# EAGLE schematic ram (EAGLE 7.3.0)
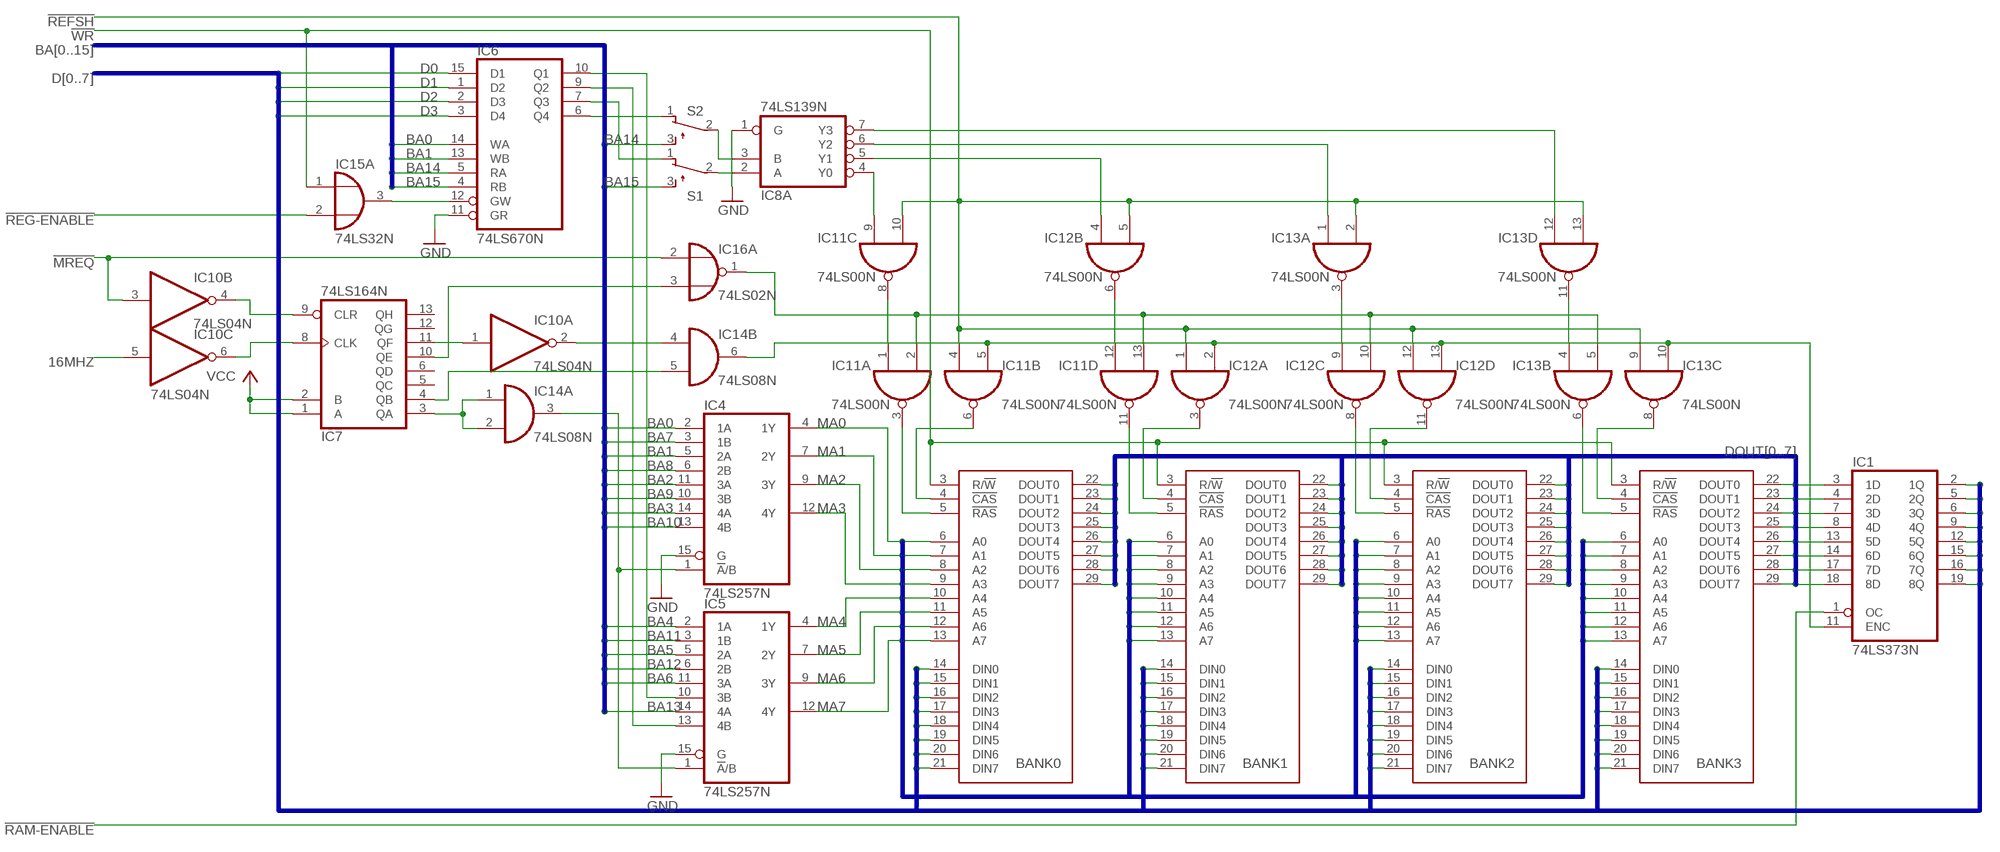
[diagram p0: schematic, sheet 1]

## Parts
BANK0  RAMBANK  [SIP29]
BANK1  RAMBANK  [SIP29]
BANK2  RAMBANK  [SIP29]
BANK3  RAMBANK  [SIP29]
IC1  74LS373N  [DIL20]
IC4  74LS257N  [DIL16]
IC5  74LS257N  [DIL16]
IC6  74LS670N  [DIL16]
IC7  74LS164N  [DIL14]
IC8  74LS139N  [DIL16]
IC10  74LS04N  [DIL14]
IC11  74LS00N  [DIL14]
IC12  74LS00N  [DIL14]
IC13  74LS00N  [DIL14]
IC14  74LS08N  [DIL14]
IC15  74LS32N  [DIL14]
IC16  74LS02N  [DIL14]
S1  TL32PO  [TL3XPO]
S2  TL32PO  [TL3XPO]

## Nets
16MHZ: IC10.5(C:I)
!MREQ!: IC10.3(B:I) IC16.2(A:I0)
!RAM-ENABLE!: IC1.1(OC)
!REFSH!: IC11.4(B:I0) IC11.10(C:I1) IC12.1(A:I0) IC12.5(B:I1) IC12.12(D:I0) IC13.2(A:I1) IC13.9(C:I0) IC13.13(D:I1)
!REG-ENABLE!: IC15.2(A:I1)
!WR!: BANK0.3(R/!W!) BANK1.3(R/!W!) BANK2.3(R/!W!) BANK3.3(R/!W!) IC15.1(A:I0)
BA0: IC4.2(1A) IC6.14(WA)
BA1: IC4.5(2A) IC6.13(WB)
BA2: IC4.11(3A)
BA3: IC4.14(4A)
BA4: IC5.2(1A)
BA5: IC5.5(2A)
BA6: IC5.11(3A)
BA7: IC4.3(1B)
BA8: IC4.6(2B)
BA9: IC4.10(3B)
BA10: IC4.13(4B)
BA11: IC5.3(1B)
BA12: IC5.6(2B)
BA13: IC5.14(4A)
BA14: IC6.5(RA) S2.3(S)
BA15: IC6.4(RB) S1.3(S)
D0: BANK0.14(DIN0) BANK1.14(DIN0) BANK2.14(DIN0) BANK3.14(DIN0) IC1.2(1Q) IC6.15(D1)
D1: BANK0.15(DIN1) BANK1.15(DIN1) BANK2.15(DIN1) BANK3.15(DIN1) IC1.5(2Q) IC6.1(D2)
D2: BANK0.16(DIN2) BANK1.16(DIN2) BANK2.16(DIN2) BANK3.16(DIN2) IC1.6(3Q) IC6.2(D3)
D3: BANK0.17(DIN3) BANK1.17(DIN3) BANK2.17(DIN3) BANK3.17(DIN3) IC1.9(4Q) IC6.3(D4)
D4: BANK0.18(DIN4) BANK0.19(DIN5) BANK1.18(DIN4) BANK2.18(DIN4) BANK3.18(DIN4) IC1.12(5Q)
D5: BANK1.19(DIN5) BANK2.19(DIN5) BANK3.19(DIN5) IC1.15(6Q)
D6: BANK0.20(DIN6) BANK1.20(DIN6) BANK2.20(DIN6) BANK3.20(DIN6) IC1.16(7Q)
D7: BANK0.21(DIN7) BANK1.21(DIN7) BANK2.21(DIN7) BANK3.21(DIN7) IC1.19(8Q)
DOUT0: BANK0.22(DOUT0) BANK1.22(DOUT0) BANK2.22(DOUT0) BANK3.22(DOUT0) IC1.3(1D)
DOUT1: BANK0.23(DOUT1) BANK1.23(DOUT1) BANK2.23(DOUT1) BANK3.23(DOUT1) IC1.4(2D)
DOUT2: BANK0.24(DOUT2) BANK1.24(DOUT2) BANK2.24(DOUT2) BANK3.24(DOUT2)
DOUT3: BANK0.25(DOUT3) BANK1.25(DOUT3) BANK2.25(DOUT3) BANK3.25(DOUT3) IC1.7(3D) IC1.8(4D)
DOUT4: BANK0.26(DOUT4) BANK1.26(DOUT4) BANK2.26(DOUT4) BANK3.26(DOUT4) IC1.13(5D)
DOUT5: BANK0.27(DOUT5) BANK1.27(DOUT5) BANK2.27(DOUT5) BANK3.27(DOUT5) IC1.14(6D) IC1.17(7D)
DOUT6: BANK0.28(DOUT6) BANK1.28(DOUT6) BANK2.28(DOUT6) BANK3.28(DOUT6) IC1.18(8D)
DOUT7: BANK0.29(DOUT7) BANK1.29(DOUT7) BANK2.29(DOUT7) BANK3.29(DOUT7)
GND: IC4.15(G) IC5.15(G) IC6.11(GR) IC8.1(A:G)
MA0: BANK0.6(A0) BANK1.6(A0) BANK2.6(A0) BANK3.6(A0) IC4.4(1Y)
MA1: BANK0.7(A1) BANK1.7(A1) BANK2.7(A1) BANK3.7(A1) IC4.7(2Y)
MA2: BANK0.8(A2) BANK1.8(A2) BANK2.8(A2) BANK3.8(A2) IC4.9(3Y)
MA3: BANK0.9(A3) BANK1.9(A3) BANK2.9(A3) BANK3.9(A3) IC4.12(4Y)
MA4: BANK0.10(A4) BANK1.10(A4) BANK2.10(A4) BANK3.10(A4) IC5.4(1Y)
MA5: BANK0.11(A5) BANK1.11(A5) BANK2.11(A5) BANK2.12(A6) BANK3.11(A5) IC5.7(2Y)
MA6: BANK0.12(A6) BANK1.12(A6) BANK3.12(A6) IC5.9(3Y)
MA7: BANK0.13(A7) BANK1.13(A7) BANK2.13(A7) BANK3.13(A7) IC5.12(4Y)
N$1: BANK0.5(!RAS!) IC11.3(A:O)
N$2: BANK0.4(!CAS!) IC11.6(B:O)
N$3: BANK1.5(!RAS!) IC11.11(D:O)
N$4: BANK1.4(!CAS!) IC12.3(A:O)
N$5: BANK2.5(!RAS!) IC12.8(C:O)
N$6: BANK2.4(!CAS!) IC12.11(D:O)
N$7: BANK3.5(!RAS!) IC13.6(B:O)
N$8: BANK3.4(!CAS!) IC13.8(C:O)
N$9: IC11.1(A:I0) IC11.8(C:O)
N$10: IC11.12(D:I0) IC12.6(B:O)
N$11: IC12.9(C:I0) IC13.3(A:O)
N$12: IC13.4(B:I0) IC13.11(D:O)
N$13: IC11.2(A:I1) IC11.13(D:I1) IC12.10(C:I1) IC13.5(B:I1) IC16.1(A:O)
N$15: IC1.11(ENC) IC11.5(B:I1) IC12.2(A:I1) IC12.13(D:I1) IC13.10(C:I1) IC14.6(B:O)
N$16: IC10.2(A:O) IC14.4(B:I0)
N$17: IC8.4(A:Y0) IC11.9(C:I0)
N$18: IC8.5(A:Y1) IC12.4(B:I0)
N$19: IC8.6(A:Y2) IC13.1(A:I0)
N$20: IC8.7(A:Y3) IC13.12(D:I0)
N$21: IC4.1(!A!/B) IC5.1(!A!/B) IC14.3(A:O)
N$22: IC7.3(QA) IC14.1(A:I0) IC14.2(A:I1)
N$23: IC5.10(3B) IC6.10(Q1)
N$24: IC5.13(4B) IC6.9(Q2)
N$25: IC7.11(QF) IC10.1(A:I)
N$26: IC8.2(A:A) S1.2(P)
N$27: IC8.3(A:B) S2.2(P)
N$28: IC7.4(QB) IC14.5(B:I1)
N$29: IC7.10(QE) IC16.3(A:I1)
N$30: IC6.7(Q3) S1.1(O)
N$31: IC6.6(Q4) S2.1(O)
N$32: IC6.12(GW) IC15.3(A:O)
N$34: IC7.8(CLK) IC10.6(C:O)
N$35: IC7.9(CLR) IC10.4(B:O)
VCC: IC7.1(A) IC7.2(B)
Unconnected: IC7.5(QC) IC7.6(QD) IC7.12(QG) IC7.13(QH) IC8.9(B:Y3) IC8.10(B:Y2) IC8.11(B:Y1) IC8.12(B:Y0) IC8.13(B:B) IC8.14(B:A) IC8.15(B:G) IC10.8(D:O) IC10.9(D:I) IC10.10(E:O) IC10.11(E:I) IC10.12(F:O) IC10.13(F:I) IC14.8(C:O) IC14.9(C:I0) IC14.10(C:I1) IC14.11(D:O) IC14.12(D:I0) IC14.13(D:I1) IC15.4(B:I0) IC15.5(B:I1) IC15.6(B:O) IC15.8(C:O) IC15.9(C:I0) IC15.10(C:I1) IC15.11(D:O) IC15.12(D:I0) IC15.13(D:I1) IC16.4(B:O) IC16.5(B:I0) IC16.6(B:I1) IC16.8(C:I0) IC16.9(C:I1) IC16.10(C:O) IC16.11(D:I0) IC16.12(D:I1) IC16.13(D:O)

## Buses
MA[0..7]
D[0..7]
DOUT[0..7]
BA[0..15]

## Power pins joined to a net without a drawn wire
GND: BANK0.2(GND) BANK1.2(GND) BANK2.2(GND) BANK3.2(GND) IC1.10(GND) IC4.8(GND) IC5.8(GND) IC6.8(GND) IC7.7(GND) IC8.8(P:GND) IC10.7(P:GND) IC11.7(P:GND) IC12.7(P:GND) IC13.7(P:GND) IC14.7(P:GND) IC15.7(P:GND) IC16.7(P:GND)
VCC: BANK0.1(VCC) BANK1.1(VCC) BANK2.1(VCC) BANK3.1(VCC) IC1.20(VCC) IC4.16(VCC) IC5.16(VCC) IC6.16(VCC) IC7.14(VCC) IC8.16(P:VCC) IC10.14(P:VCC) IC11.14(P:VCC) IC12.14(P:VCC) IC13.14(P:VCC) IC14.14(P:VCC) IC15.14(P:VCC) IC16.14(P:VCC)

## Library data of the parts
BANK0 BANK1-BANK3 = ram:RAMBANK: HM4864 RAM Bank
IC1 = 74xx-eu:74*373: Octal D type transparent LATCH, edge triggered
IC4 IC5 = 74xx-eu:74*257: Quadruple 2-to 1 line data SELECTOR/MULTIPLEXER
IC6 = 74xx-eu:74*670: 4 by 4 REGISTER FILES, 3-state
IC7 = 74xx-eu:74*164: 8-bit parallel out SHIFT REGISTER
IC8 = 74xx-eu:74*139: Dual 2-line to 4-line DECODER/DEMULTIPLEXER
IC10 = 74xx-eu:74*04: Hex INVERTER
IC11-IC13 = 74xx-eu:74*00: Quad 2-input NAND gate
IC14 = 74xx-eu:74*08: Quad 2-input AND gate
IC15 = 74xx-eu:74*32: Quad 2-input OR gate
IC16 = 74xx-eu:74*02: Quad 2-input NOR gate
S1 S2 = switch:TL32PO: TINY SWITCH ON - MOM Source: http://www2.produktinfo.conrad.com/datenblaetter/700000-724999/705152-da-01-de-Subminiaturschalter_TL_36YO.pdf